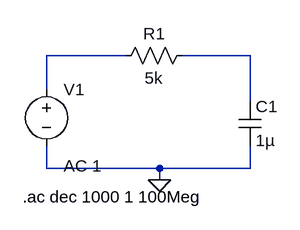
[diagram p0: schematic bode1.asc]
bode1.asc, the LTspice schematic file:
Version 4
SHEET 1 880 680
WIRE 96 112 -16 112
WIRE 272 112 176 112
WIRE -16 160 -16 112
WIRE 272 176 272 112
WIRE -16 272 -16 240
WIRE 144 272 -16 272
WIRE 272 272 272 240
WIRE 272 272 144 272
WIRE 144 288 144 272
FLAG 144 288 0
SYMBOL res 192 96 R90
WINDOW 0 0 56 VBottom 2
WINDOW 3 32 56 VTop 2
SYMATTR InstName R1
SYMATTR Value 5k
SYMBOL cap 256 176 R0
SYMATTR InstName C1
SYMATTR Value 1µ
SYMBOL voltage -16 144 R0
WINDOW 123 24 124 Left 2
WINDOW 39 0 0 Left 2
SYMATTR InstName V1
SYMATTR Value ""
SYMATTR Value2 AC 1
TEXT -50 312 Left 2 !.ac dec 1000 1 100Meg

The netlist it stands for:
* bode1.asc
R1 N002 N001 5k
C1 N002 0 1µ
V1 N001 0 AC 1
.ac dec 1000 1 100Meg
.backanno
.end